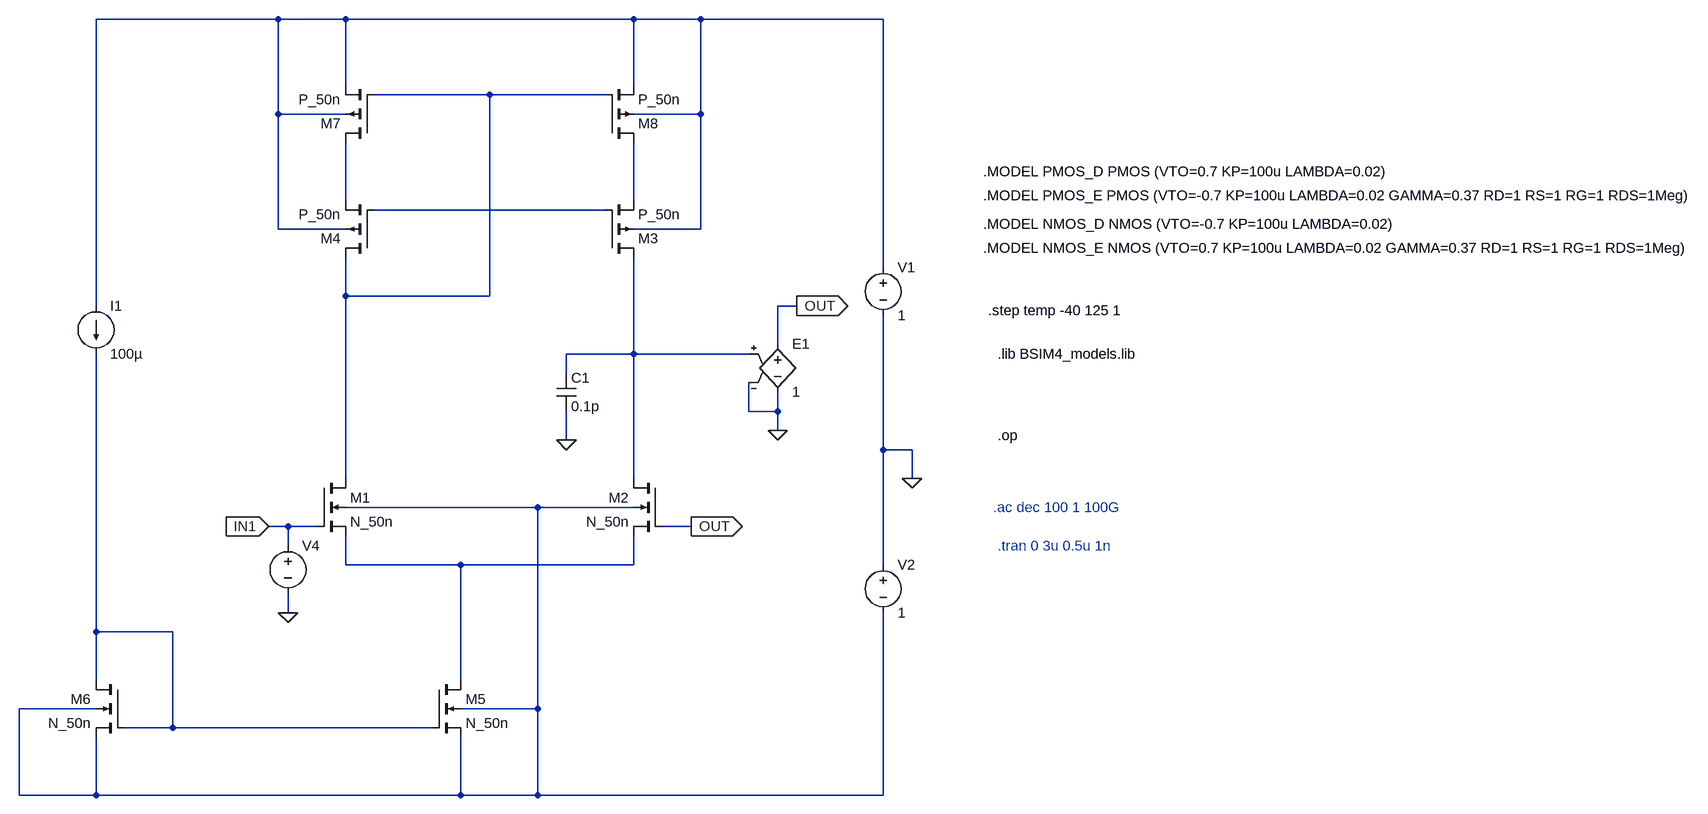
[diagram p0: schematic opamp_v1.asc]
opamp_v1.asc, the LTspice schematic file:
Version 4
SHEET 1 3416 776
WIRE -96 -656 -400 -656
WIRE 16 -656 -96 -656
WIRE 496 -656 16 -656
WIRE 608 -656 496 -656
WIRE 912 -656 608 -656
WIRE 16 -496 16 -656
WIRE 496 -496 496 -656
WIRE 256 -480 64 -480
WIRE 448 -480 256 -480
WIRE -96 -448 -96 -656
WIRE 16 -448 -96 -448
WIRE 608 -448 608 -656
WIRE 608 -448 496 -448
WIRE 16 -304 16 -400
WIRE 496 -304 496 -400
WIRE 448 -288 64 -288
WIRE -96 -256 -96 -448
WIRE 16 -256 -96 -256
WIRE 608 -256 608 -448
WIRE 608 -256 496 -256
WIRE 912 -192 912 -656
WIRE 16 -144 16 -208
WIRE 256 -144 256 -480
WIRE 256 -144 16 -144
WIRE -400 -128 -400 -656
WIRE 768 -128 736 -128
WIRE 736 -64 736 -128
WIRE 496 -48 496 -208
WIRE 496 -48 384 -48
WIRE 688 -48 496 -48
WIRE 384 -16 384 -48
WIRE 688 48 688 0
WIRE 736 48 736 16
WIRE 736 48 688 48
WIRE 736 80 736 48
WIRE 384 96 384 48
WIRE 912 112 912 -112
WIRE 960 112 912 112
WIRE 16 160 16 -144
WIRE 496 160 496 -48
WIRE 960 160 960 112
WIRE 336 208 16 208
WIRE 496 208 336 208
WIRE -80 240 -112 240
WIRE -32 240 -80 240
WIRE 592 240 544 240
WIRE -80 272 -80 240
WIRE 16 304 16 256
WIRE 208 304 16 304
WIRE 496 304 496 256
WIRE 496 304 208 304
WIRE 912 304 912 112
WIRE -80 384 -80 352
WIRE -400 416 -400 -48
WIRE -272 416 -400 416
WIRE -400 496 -400 416
WIRE 208 496 208 304
WIRE -400 544 -528 544
WIRE 336 544 336 208
WIRE 336 544 208 544
WIRE -272 576 -272 416
WIRE -272 576 -352 576
WIRE 160 576 -272 576
WIRE -528 688 -528 544
WIRE -400 688 -400 592
WIRE -400 688 -528 688
WIRE 208 688 208 592
WIRE 208 688 -400 688
WIRE 336 688 336 544
WIRE 336 688 208 688
WIRE 912 688 912 384
WIRE 912 688 336 688
FLAG 960 160 0
FLAG -112 240 IN1
IOPIN -112 240 In
FLAG 768 -128 OUT
IOPIN 768 -128 Out
FLAG -80 384 0
FLAG 736 80 0
FLAG 592 240 OUT
IOPIN 592 240 Out
FLAG 384 96 0
DATAFLAG 16 0 ""
DATAFLAG 608 -48 ""
DATAFLAG 800 -656 ""
DATAFLAG 784 688 ""
DATAFLAG 192 304 ""
DATAFLAG 80 480 "Id(M5)"
DATAFLAG -80 576 ""
SYMBOL voltage 912 -208 R0
SYMATTR InstName V1
SYMATTR Value 1
SYMBOL voltage 912 288 R0
WINDOW 123 0 0 Left 0
WINDOW 39 0 0 Left 0
SYMATTR InstName V2
SYMATTR Value 1
SYMBOL voltage -80 256 R0
WINDOW 39 0 0 Left 0
WINDOW 3 24 96 Invisible 2
SYMATTR Value PULSE(0 0.5 1u 1f 1f 1u 4u)
SYMATTR Value2 AC 0.5 0
SYMATTR InstName V4
SYMBOL e 736 -80 R0
SYMATTR InstName E1
SYMATTR Value 1
SYMBOL cap 368 -16 R0
SYMATTR InstName C1
SYMATTR Value 0.1p
SYMBOL nmos4 160 496 R0
SYMATTR InstName M5
SYMATTR Value N_50n
SYMATTR Value2 l=50n w=500n
SYMBOL nmos4 -32 160 R0
SYMATTR InstName M1
SYMATTR Value N_50n
SYMATTR Value2 l=50n w=500n
SYMBOL nmos4 544 160 M0
SYMATTR InstName M2
SYMATTR Value N_50n
SYMATTR Value2 l=50n w=500n
SYMBOL pmos4 448 -208 M180
SYMATTR InstName M3
SYMATTR Value P_50n
SYMATTR Value2 l=50n w=1000n
SYMBOL pmos4 64 -208 R180
SYMATTR InstName M4
SYMATTR Value P_50n
SYMATTR Value2 l=50n w=1000n
SYMBOL nmos4 -352 496 M0
SYMATTR InstName M6
SYMATTR Value N_50n
SYMATTR Value2 l=50n w=500n
SYMBOL current -400 -128 R0
SYMATTR InstName I1
SYMATTR Value 100µ
SYMBOL pmos4 64 -400 R180
SYMATTR InstName M7
SYMATTR Value P_50n
SYMATTR Value2 l=50n w=1000n
SYMBOL pmos4 448 -400 M180
SYMATTR InstName M8
SYMATTR Value P_50n
SYMATTR Value2 l=50n w=1000n
TEXT 1648 88 Left 2 !.op
TEXT 1640 208 Left 2 ;.ac dec 100 1 100G
TEXT 1624 -224 Left 2 !.MODEL NMOS_E NMOS (VTO=0.7 KP=100u LAMBDA=0.02 GAMMA=0.37 RD=1 RS=1 RG=1 RDS=1Meg)
TEXT 1624 -264 Left 2 !.MODEL NMOS_D NMOS (VTO=-0.7 KP=100u LAMBDA=0.02)
TEXT 1624 -312 Left 2 !.MODEL PMOS_E PMOS (VTO=-0.7 KP=100u LAMBDA=0.02 GAMMA=0.37 RD=1 RS=1 RG=1 RDS=1Meg)
TEXT 1624 -352 Left 2 !.MODEL PMOS_D PMOS (VTO=0.7 KP=100u LAMBDA=0.02)
TEXT 1648 272 Left 2 ;.tran 0 3u 0.5u 1n
TEXT 1632 -120 Left 2 !.step temp -40 125 1
TEXT 1648 -48 Left 2 !.lib BSIM4_models.lib

The netlist it stands for:
* opamp_v1.asc
V1 N001 0 1
V2 0 N007 1
V4 IN1 0 PULSE(0 0.5 1u 1f 1f 1u 4u) AC 0.5 0
E1 OUT 0 N006 0 1
C1 N006 0 0.1p
M5 N008 N009 N007 N007 N_50n l=50n w=500n
M1 N002 IN1 N008 N007 N_50n l=50n w=500n
M2 N006 OUT N008 N007 N_50n l=50n w=500n
M3 N006 N005 N004 N001 P_50n l=50n w=1000n
M4 N002 N005 N003 N001 P_50n l=50n w=1000n
M6 N009 N009 N007 N007 N_50n l=50n w=500n
I1 N001 N009 100µ
M7 N003 N002 N001 N001 P_50n l=50n w=1000n
M8 N004 N002 N001 N001 P_50n l=50n w=1000n
.model NMOS NMOS
.model PMOS PMOS
.lib standard.mos
.op
* .ac dec 100 1 100G
.MODEL NMOS_E NMOS (VTO=0.7 KP=100u LAMBDA=0.02 GAMMA=0.37 RD=1 RS=1 RG=1 RDS=1Meg)
.MODEL NMOS_D NMOS (VTO=-0.7 KP=100u LAMBDA=0.02)
.MODEL PMOS_E PMOS (VTO=-0.7 KP=100u LAMBDA=0.02 GAMMA=0.37 RD=1 RS=1 RG=1 RDS=1Meg)
.MODEL PMOS_D PMOS (VTO=0.7 KP=100u LAMBDA=0.02)
* .tran 0 3u 0.5u 1n
.step temp -40 125 1
.lib BSIM4_models.lib
.backanno
.end